# EAGLE design Fuente lineal +12V,-12V,+5V - 500mA (EAGLE 7.6.0)
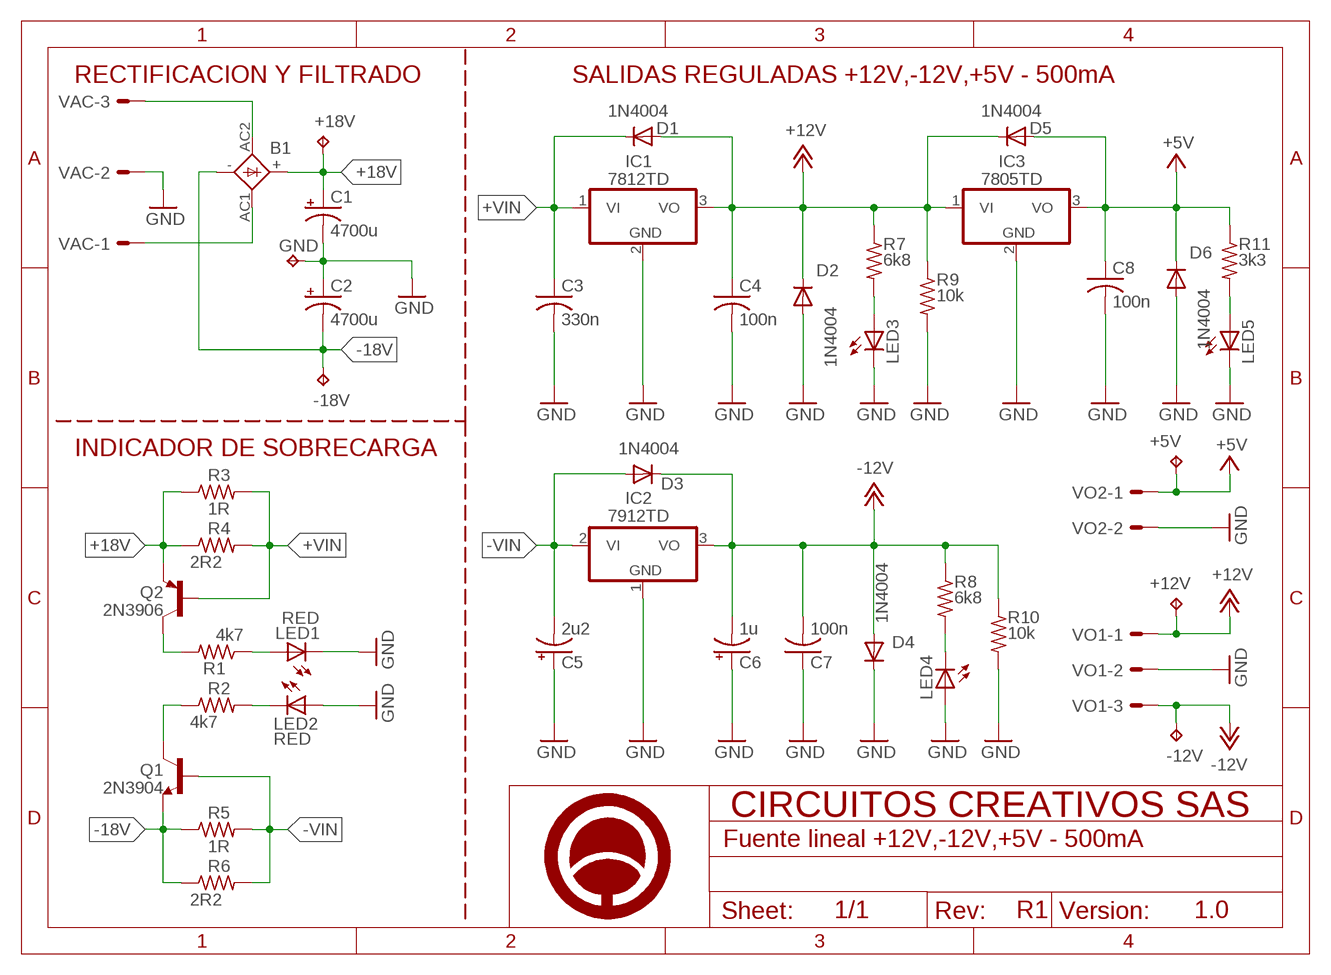
[diagram p0: schematic, sheet 1]

## Parts
+5V  TPPAD1-17  [P1-17]
+12V  TPPAD1-17  [P1-17]
+18V  TPPAD1-17  [P1-17]
-12V  TPPAD1-17  [P1-17]
-18V  TPPAD1-17  [P1-17]
B1  KBL  [KBL]
C1  4700u  CPOL-USE7.5-16  [E7,5-16]
C2  4700u  CPOL-USE7.5-16  [E7,5-16]
C3  330n  C-US050-030X075  [C050-030X075]
C4  100n  C-US050-030X075  [C050-030X075]
C5  2u2  CPOL-USE2,5-6E  [E2,5-6E]
C6  1u  CPOL-USE2,5-6E  [E2,5-6E]
C7  100n  C-US050-030X075  [C050-030X075]
C8  100n  C-US050-030X075  [C050-030X075]
D1  1N4004  [DO41-10]
D2  1N4004  [DO41-10]
D3  1N4004  [DO41-10]
D4  1N4004  [DO41-10]
D5  1N4004  [DO41-10]
D6  1N4004  [DO41-10]
FRAME1  A5_HORIZONTAL  [LOGO]
GND  TPPAD1-17  [P1-17]
IC1  7812TD  [TO220VD]
IC2  7912TD  [TO220VD]
IC3  7805TD  [TO220VD]
LED1  RED  LED5MM  [LED5MM]
LED2  RED  LED5MM  [LED5MM]
LED3  LED5MM  [LED5MM]
LED4  LED5MM  [LED5MM]
LED5  LED5MM  [LED5MM]
Q1  2N3904  [TO-92]
Q2  2N3906  [TO-92]
R1  4k7  R-US_0204/7  [0204/7]
R2  4k7  R-US_0204/7  [0204/7]
R3  1R  R-US_0922/22  [0922/22]
R4  2R2  R-US_0922/22  [0922/22]
R5  1R  R-US_0922/22  [0922/22]
R6  2R2  R-US_0922/22  [0922/22]
R7  6k8  R-US_0204/7  [0204/7]
R8  6k8  R-US_0204/7  [0204/7]
R9  10k  R-US_0204/7  [0204/7]
R10  10k  R-US_0204/7  [0204/7]
R11  3k3  R-US_0204/7  [0204/7]
VAC  KK-156-3  [KK-156-3]
VO1  KK-156-3  [KK-156-3]
VO2  KK-156-2  [KK-156-2]

## Nets
+5V: +5V.TP C8.1 D5.A D6.C IC3.3(VO) R11.1 VO2.1
+12V: +12V.TP C4.1 D1.A D2.C D5.C IC1.3(VO) IC3.1(VI) R7.1 R9.1 VO1.1
+18V: +18V.TP B1.+ C1.+ Q2.1(E) R3.1 R4.1
+VIN: C3.1 D1.C IC1.1(VI) Q2.2(B) R3.2 R4.2
-12V: -12V.TP C6.- C7.2 D3.C D4.A IC2.3(VO) R8.1 R10.1 VO1.3
-18V: -18V.TP B1.- C2.- Q1.1(E) R5.1 R6.1
-VIN: C5.- D3.A IC2.2(VI) Q1.2(B) R5.2 R6.2
GND: C1.- C2.+ C3.2 C4.2 C5.+ C6.+ C7.1 C8.2 D2.A D4.C D6.A GND.TP IC1.2(GND) IC2.1(GND) IC3.2(GND) LED1.K(C) LED2.A LED3.K(C) LED4.A LED5.K(C) R9.2 R10.2 VAC.2 VO1.2 VO2.2
N$1: B1.AC2(AC1) VAC.3
N$2: B1.AC1(AC2) VAC.1
N$3: Q2.3(C) R1.2
N$4: LED4.K(C) R8.2
N$5: Q1.3(C) R2.1
N$6: LED3.A R7.2
N$7: LED5.A R11.2
N$8: LED1.A R1.1
N$9: LED2.K(C) R2.2

## Notes on the sheet
- RECTIFICACION Y FILTRADO | SALIDAS REGULADAS +12V,-12V,+5V - 500mA
- INDICADOR DE SOBRECARGA
- R1 | 1.0

## Library data of the parts
+5V +12V +18V -12V -18V GND = testpad:TP: Test pad
B1 = rectifier:KBL: DIOTEC RECTIFIER
C1 C2 C5 C6 = rcl:CPOL-US: POLARIZED CAPACITOR, American symbol
C3 C4 C7 C8 = rcl:C-US: CAPACITOR, American symbol
D1-D6 = diode:1N4004: DIODE general purpose rectifier, 1 A
FRAME1 = Circuitos-Creativos-Estilos:A5_HORIZONTAL
IC1 IC3 = linear:78*: Positive VOLTAGE REGULATOR Source: http://cache.national.com/ds/LM/LM78L05.pdf http://www.fairchildsemi.com/ds/LM/LM7805.pdf
IC2 = linear:79*: Negative VOLTAGE REGULATOR
LED1-LED5 = led:LED: LED OSRAM: - CHIPLED LG R971, LG N971, LY N971, LG Q971, LY Q971, LO R971, LY R971 LH N974, LH R974 LS Q976, LO Q976, LY Q976 LO Q996 - Hyper CHIPLED LW Q18S LB Q993, LB Q99A, LB R99A - SideLED LS A670, LO A670, LY A670, LG A670, LP A670 LB A673, LV A673, LT A673, LW A673 LH A674 LY A675 LS A676, LA A676, LO A676, LY A676, LW A676 LS A679, LY A679, LG A679 - Hyper Micro SIDELED® LS Y876, LA Y876, LO Y876, LY Y876 LT Y87S - SmartLED LW L88C, LW L88S LB L89C, LB L89S, LG L890 LS L89K, LO L89K, LY L89K LS L896, LA L896, LO L896, LY L896 - TOPLED LS T670, LO T670, LY T670, LG T670, LP T670 LSG T670, LSP T670, LSY T670, LOP T670, LYG T670 LG T671, LOG T671, LSG T671 LB T673, LV T673, LT T673, LW T673 LH T674 LS T676, LA T676, LO T676, LY T676, LB T676, LH T676, LSB T676, LW T676 LB T67C, LV T67C, LT T67C, LS T67K, LO T67K, LY T67K, LW E67C LS E67B, LA E67B, LO E67B, LY E67B, LB E67C, LV E67C, LT E67C LW T67C LS T679, LY T679, LG T679 LS T770, LO T770, LY T770, LG T770, LP T770 LB T773, LV T773, LT T773, LW T773 LH T774 LS E675, LA E675, LY E675, LS T675 LS T776, LA T776, LO T776, LY T776, LB T776 LHGB T686 LT T68C, LB T68C - Hyper Mini TOPLED® LB M676 - Mini TOPLED Santana® LG M470 LS M47K, LO M47K, LY M47K Source: http://www.osram.convergy.de LUXEON: - LUMILED® LXK2-PW12-R00, LXK2-PW12-S00, LXK2-PW14-U00, LXK2-PW14-V00 LXK2-PM12-R00, LXK2-PM12-S00, LXK2-PM14-U00 LXK2-PE12-Q00, LXK2-PE12-R00, LXK2-PE12-S00, LXK2-PE14-T00, LXK2-PE14-U00 LXK2-PB12-K00, LXK2-PB12-L00, LXK2-PB12-M00, LXK2-PB14-N00, LXK2-PB14-P00, LXK2-PB14-Q00 LXK2-PR12-L00, LXK2-PR12-M00, LXK2-PR14-Q00, LXK2-PR14-R00 LXK2-PD12-Q00, LXK2-PD12-R00, LXK2-PD12-S00 LXK2-PH12-R00, LXK2-PH12-S00 LXK2-PL12-P00, LXK2-PL12-Q00, LXK2-PL12-R00 Source: www.luxeon.com KINGBRIGHT: KA-3528ASYC Source: www.kingbright.com
Q1 = Ingenialo:2N3904: transistor NPN de proposito general
Q2 = Ingenialo:2N3906: Transistor PNP de proposito general
R1-R11 = rcl:R-US_: RESISTOR, American symbol
VAC VO1 = con-molex:KK-156-3: KK 156 HEADER Source: http://www.molex.com/pdm_docs/sd/026604100_sd.pdf; OC_FARNELL: unknown; OC_NEWARK: unknown
VO2 = con-molex:KK-156-2: KK 156 HEADER Source: http://www.molex.com/pdm_docs/sd/026604100_sd.pdf; OC_FARNELL: unknown; OC_NEWARK: unknown

## Board
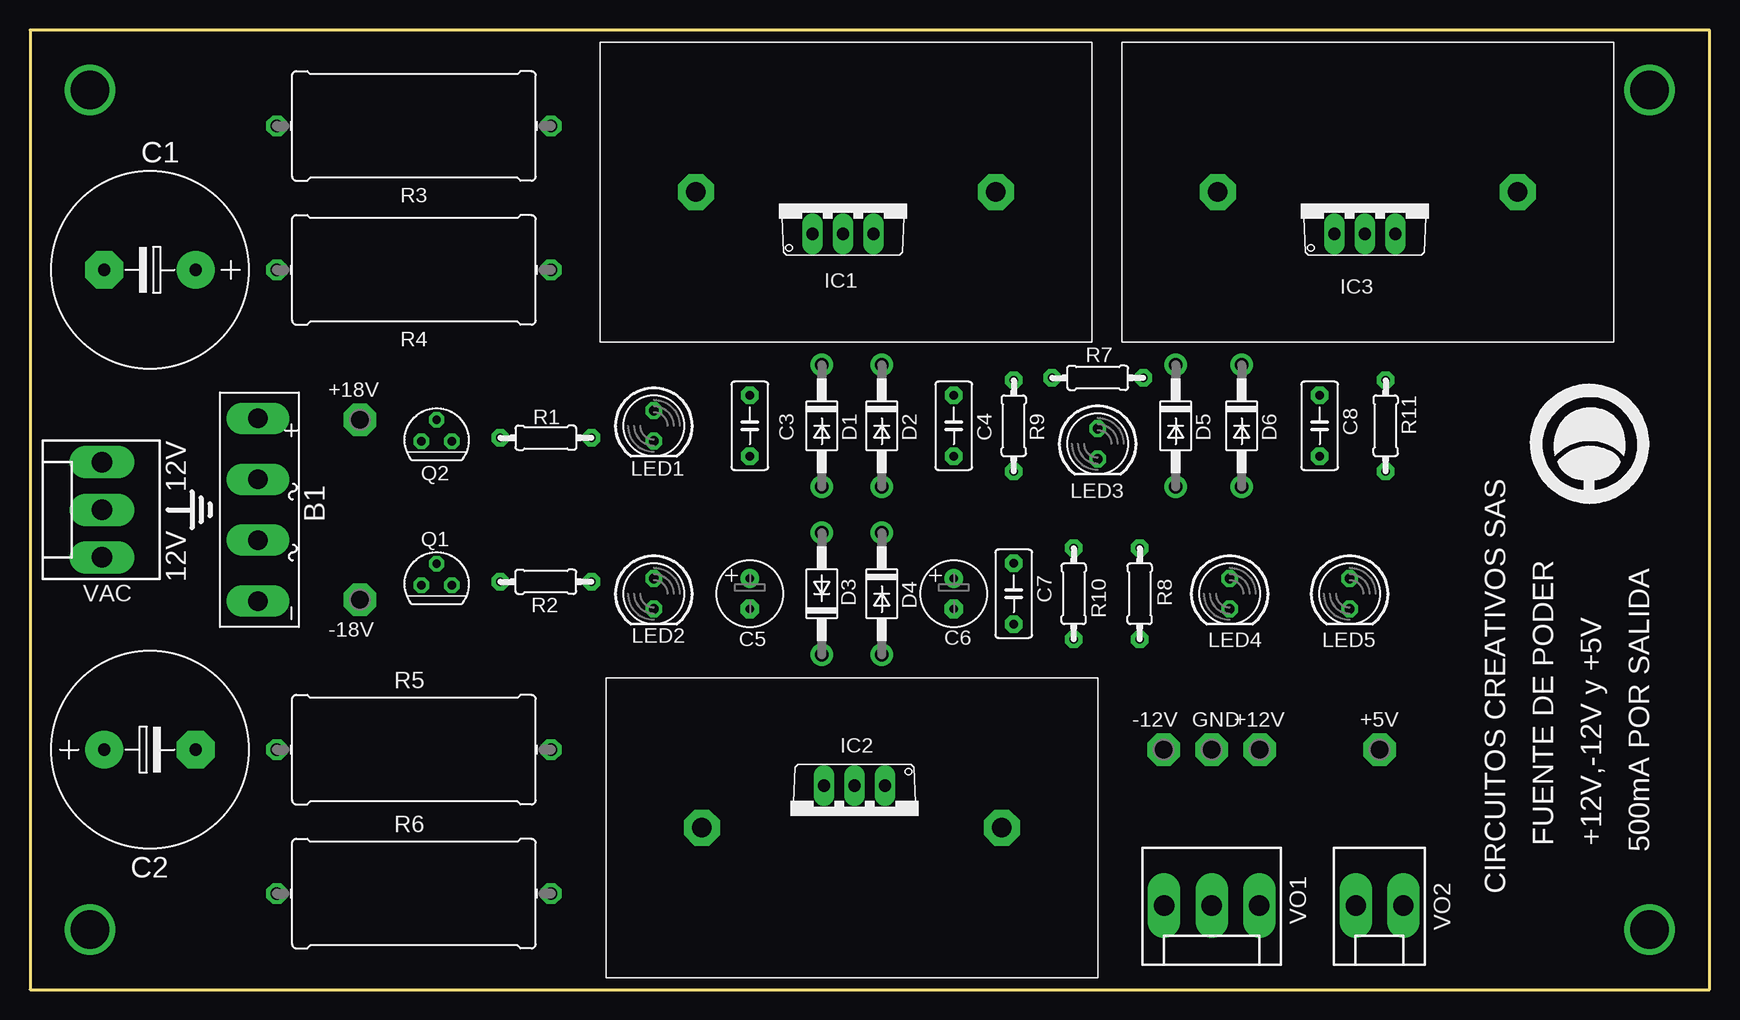
[diagram p1: board, top side]
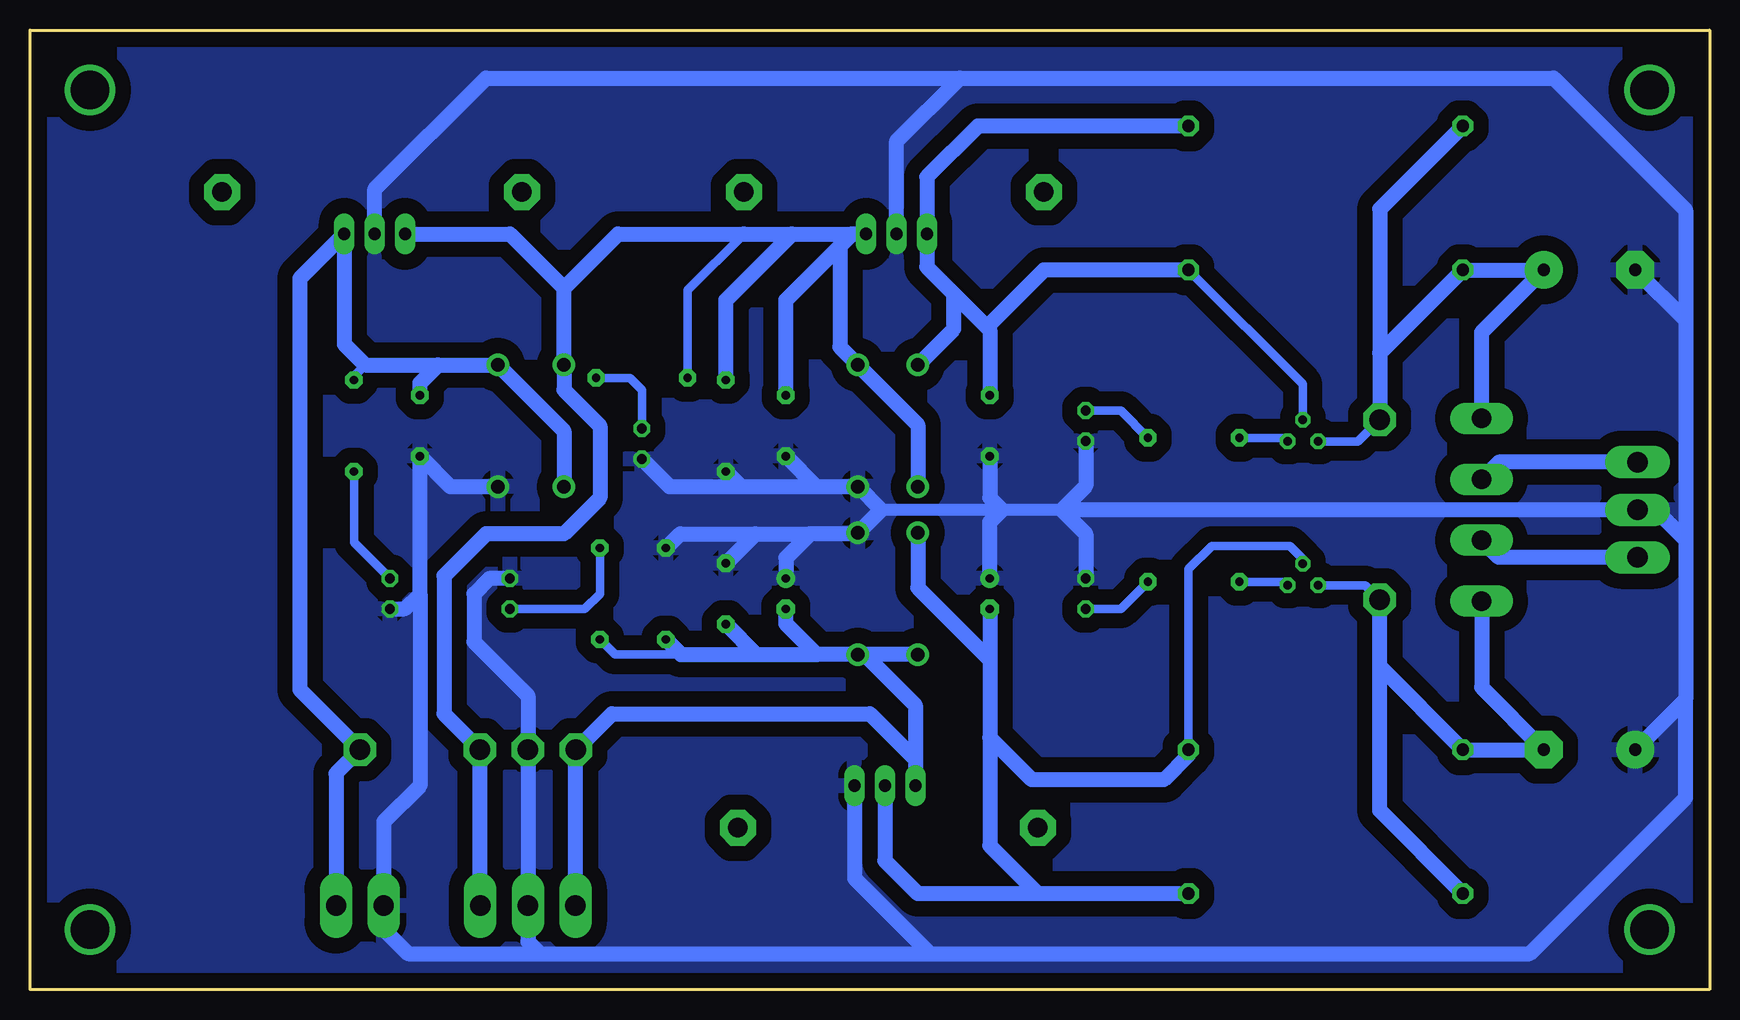
[diagram p2: board, bottom side, seen from below]

Size 140 x 80 mm. Coordinates in mm from the lower left corner, seen from the top.
Outline: 0,0 140,0 140,80 0,80 0,0
Copper layers (1*16): Top 0.035mm / dielectric 1.5mm / Bottom 0.035mm
Design rules "DRC_Serigrafia_1capa *": minimum track width 0.7mm, minimum drill 0.7mm, track to track 15mil, track to pad 15mil, pad to pad 15mil, via to via 15mil, smd to smd 10mil, copper to edge 40mil, drill to drill 15mil, minimum pad ring 10mil, minimum via ring 8mil, stop-mask expansion 4mil, vias tented up to drill 0mil, thermal gap 20mil

### Footprints (pad centres in the part's own frame; a part is rotated, then mirrored left to right if it is on the bottom)
P1-17 = drill 1.702 pad 2.54 octagon: TP 0,0
KBL = drill 1.6 long: + -7.62,0; - 7.62,0; AC1 2.54,0; AC2 -2.54,0
E7,5-16 = drill 1.016 pad 3.15: + -3.81,0 | drill 1.016 pad 3.15 octagon: - 3.81,0
C050-030X075 = drill 0.7 pad 1.422 octagon: 1 -2.54,0; 2 2.54,0
E2,5-6E = drill 0.7 pad 1.575: + -1.27,0 | drill 0.7 pad 1.575 octagon: - 1.27,0
DO41-10 = drill 1.118: A 5.08,0; C -5.08,0
TO220VD = drill 1.016 long: 1 17.73,9; 2 20.27,9; 3 22.81,9 | drill 1.6 pad 3 octagon: P$1 8,12.5; P$2 33,12.5
LED5MM = drill 0.813 octagon: A -1.27,0; K 1.27,0
TO-92 = drill 0.7 pad 1.27 octagon: 1 -1.37,-0.3; 2 -0.1,1.505; 3 1.17,-0.3
0204/7 = drill 0.7 pad 1.422 octagon: 1 -3.81,0; 2 3.81,0
0922/22 = drill 1.016 pad 1.676 octagon: 1 -11.43,0; 2 11.43,0
KK-156-3 = drill 1.7 pad 2.184 long: 1 -3.96,0; 2 0,0; 3 3.96,0
KK-156-2 = drill 1.7 pad 2.184 long: 1 -1.98,0; 2 1.98,0

### Placement (x,y rotation side)
+5V  112.5,20 0 top
+12V  102.5,20 0 top
+18V  27.5,47.5 0 top
-12V  94.5,20 0 top
-18V  27.5,32.5 0 top
B1  19,40 270 top
C1  10,60 180 top
C2  10,20 0 top
C3  60,47 270 top
C4  77,47 270 top
C5  60,33 270 top
C6  77,33 270 top
C7  82,33 270 top
C8  107.5,47 270 top
D1  66,47 270 top
D2  71,47 270 top
D3  66,33 90 top
D4  71,33 270 top
D5  95.5,47 270 top
D6  101,47 270 top
FRAME1  130,45.5 0 top
GND  98.5,20 0 top
IC1  47.5,54 0 top
IC2  89,26 180 top
IC3  91,54 0 top
LED1  52,47 270 top
LED2  52,33 270 top
LED3  89,45.5 270 top
LED4  100,33 270 top
LED5  110,33 270 top
Q1  34,34 0 top
Q2  34,46 0 top
R1  43,46 180 top
R2  43,34 0 top
R3  32,72 0 top
R4  32,60 0 top
R5  32,20 0 top
R6  32,8 0 top
R7  89,51 0 top
R8  92.5,33 90 top
R9  82,47 270 top
R10  87,33 90 top
R11  113,47 270 top
VAC  6,40 90 top
VO1  98.5,7 180 top
VO2  112.5,7 180 top

### Tracks (layer width: path | path; a pad name or v marks a point on that pad's centre or on a via)
0  (via drill 3.2 pad 3.81)
  other vias: 5,5
+5V
  Bottom 0.7: R11.1 113,51.16 112.08,52.08
  Bottom 1.27: D5.A 95.5,46.58 D6.C 106,52.08 | 106,52.08 112.08,52.08 113.81,53.81 IC3.3 117.5,59.31 117.5,25 +5V.TP 114.48,18.02 VO2.1 | C8.1 107.5,50.58 106,52.08
+12V
  Bottom 0.7: R7.1 85.19,58.31 80.5,63
  Bottom 1.27: 72.5,62 71.5,63 IC1.3 76.5,63 | 72.5,62 72.5,53.58 D2.C 66,47.08 D1.A | C4.1 77,57.5 72.5,62 | R9.1 82,57.5 76.5,63 | 76.5,63 80.5,63 91,63 95.5,58.5 | 95.5,58.5 D5.C 95.5,50 92.5,47 92.5,41 95.5,38 102,38 105.5,34.5 105.5,23 +12V.TP 102.46,19.96 VO1.1 | IC3.1 100,63 95.5,58.5
+18V
  Bottom 0.7: +18V.TP 29.3,45.7 Q2.1
  Bottom 1.27: B1.+ 19,54.81 C1.+ R4.1 27.5,53.07 | 27.5,53.07 +18V.TP | R3.1 27.5,65.07 27.5,53.07
+VIN
  Bottom 0.7: Q2.2 33.9,50.47 R4.2
  Bottom 1.27: R3.2 61,72 65.23,67.77 IC1.1 65.23,60.23 63,58 | 63,58 60.25,55.25 | 60.25,55.25 60,55 C3.1 | D1.C 63,55.08 63,58 | R4.2 55.5,60 60.25,55.25
-12V
  Bottom 0.7: R8.1 91.23,27.92 85.73,27.92
  Bottom 1.27: 74.42,27.92 77,30.5 C6.- | C7.2 79.46,27.92 | 79.46,27.92 74.42,27.92 | R10.1 85.73,27.92 79.46,27.92 | VO1.3 94.54,19.96 -12V.TP 91.5,23 70,23 66.19,19.19 | 66.19,19.19 IC2.3 | D4.A 74.42,27.92 | D4.A 70.42,27.92 66.19,23.69 66.19,19.19 | D3.C D4.A
-18V
  Bottom 0.7: -18V.TP 28.7,33.7 Q1.1
  Bottom 1.27: B1.- 19,25.19 C2.- 13.89,19.92 20.57,19.92 R5.1 27.5,26.93 | 27.5,26.93 -18V.TP | R6.1 27.5,14.93 27.5,26.93
-VIN
  Bottom 0.7: Q1.2 33.9,35.9 35,37 41.5,37 43.43,35.07 R5.2
  Bottom 1.27: C5.- 60,27.5 | 60,27.5 60,21 | 60,21 60,12 56,8 | D3.A 66,33.5 60,27.5 | IC2.2 68.73,10.73 66,8 56,8 | R6.2 56,8 | R5.2 43.43,19.57 45.5,17.5 56.5,17.5 60,21
GND
  Bottom 1.016: 69.08,40 59,40 54,40
  Bottom 1.27: 2,37.5 4.5,40 VAC.2 54,40 | 2,37.5 2,24.19 | 2,24.19 C2.+ | C1.- 2,55.81 | 2,55.81 2,37.5 | IC1.2 67.77,70.73 62.5,76 | 62.5,76 13,76 2,65 2,55.81 | C4.2 74.46,41.92 | 74.46,41.92 D2.A 69.08,40 D4.C 71.08,38 75,38 | 75,38 77,36 C6.+ | IC2.1 71.27,9.27 65,3 | 65,3 15,3 2,16 2,24.19 | C7.1 79.54,38 | 79.54,38 75,38 | R10.2 85.81,38 79.54,38 | R9.2 80.73,41.92 | 80.73,41.92 74.46,41.92 | LED3.K 86.69,41.92 80.73,41.92 | D6.A 104.96,41.92 C8.2 107.5,33 | 97.5,3 98.5,4 VO1.2 GND.TP 98.5,24.5 103,29 103,33 101.73,34.27 LED4.A | 97.5,3 65,3 | C5.+ 60,39 59,40 60,41 C3.2 | LED1.K 52,42 54,40 | 54,40 52,38 LED2.A | IC3.2 111.27,66.73 102,76 62.5,76 | 97.5,3 108.5,3 110.52,5.02 VO2.2 110.52,13.98 107.5,17 107.5,33 | LED5.K 108.77,31.73 107.5,33
  pour Bottom (isolate 1.27): -1,81 141,81 141,-1 -1,-1
N$1
  Bottom 1.27: VAC.3 17.58,43.96 B1.AC2
N$2
  Bottom 1.27: VAC.1 17.58,36.04 B1.AC1
N$3
  Bottom 0.7: R1.2 35.47,46 Q2.3
N$4
  Bottom 0.7: LED4.K 93.77,31.73 92.5,33 R8.2
N$5
  Bottom 0.7: R2.1 35.47,34 Q1.3
N$6
  Bottom 0.7: R7.2 90,51 89,50 LED3.A
N$7
  Bottom 0.7: R11.2 113,37.27 LED5.A
N$8
  Bottom 0.7: LED1.A 49.08,48.27 R1.1
N$9
  Bottom 0.7: R2.2 49.08,31.73 LED2.K
N$10  (via drill 3.2 pad 3.81)
  other vias: 5,75
N$11  (via drill 3.2 pad 3.81)
  other vias: 135,75
N$12  (via drill 3.2 pad 3.81)
  other vias: 135,5

### Text on the board
tPlace: 12V | 12V | FUENTE DE PODER | +12V,-12V y +5V | 500mA POR SALIDA | CIRCUITOS CREATIVOS SAS